# EAGLE design Encoder (EAGLE 9.0.0)
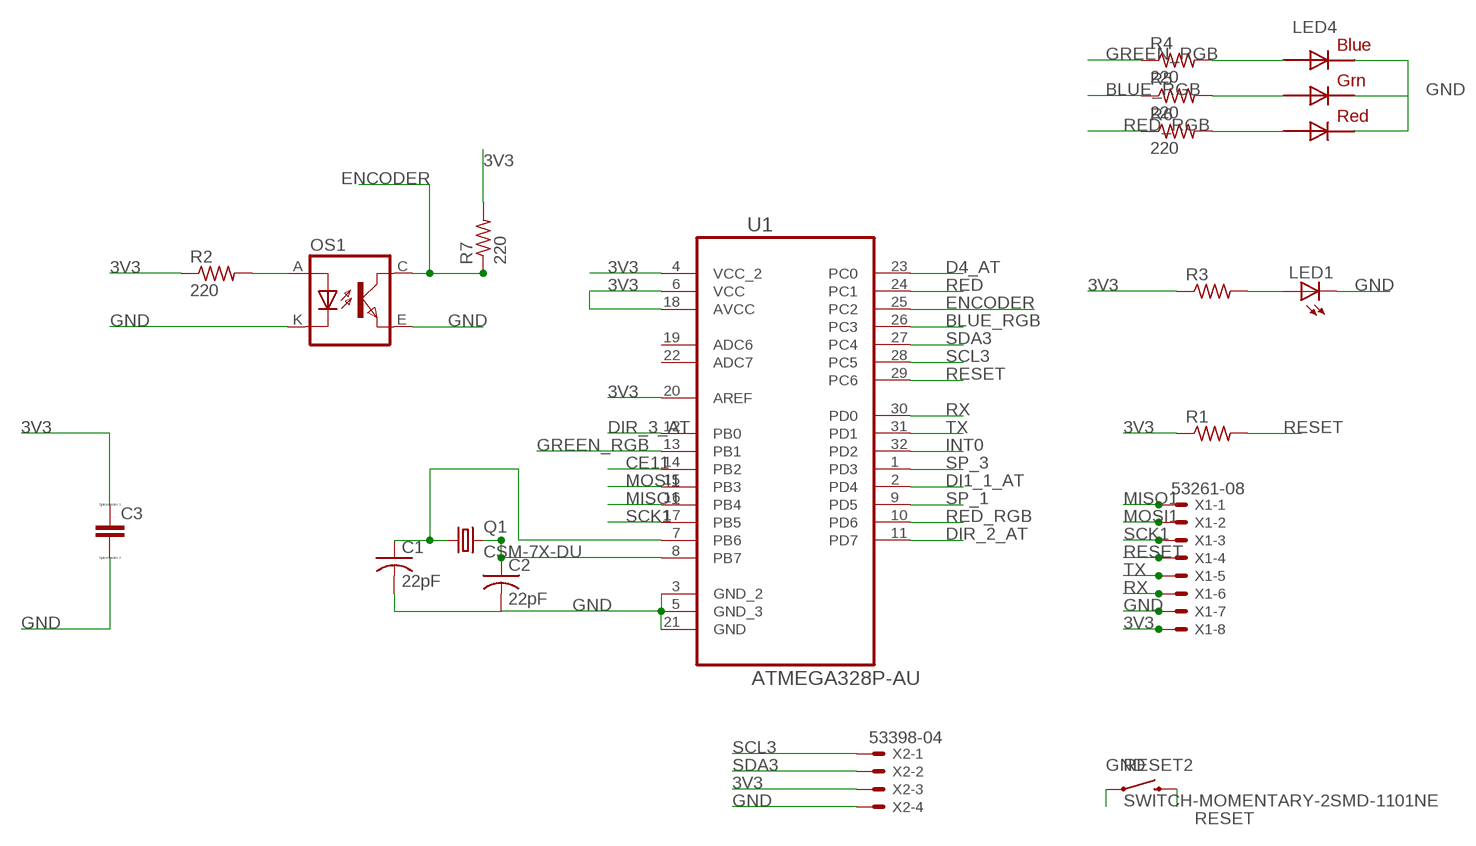
[diagram p0: schematic, sheet 1]

## Parts
C1  22pF  C-USC0603  [C0603]
C2  22pF  C-USC0603  [C0603]
C3  CC1206  [C1206]
LED1  LEDCHIPLED_1206  [CHIPLED_1206]
LED4  RGBLED5050  [RGBLED5050]
OS1  TCRT5000  [TCRT5000]
Q1  CSM-7X-DU  [CSM-7X-DU]
R1  R-US_M1206  [M1206]
R2  220  R-US_R0603  [R0603]
R3  R-US_M1206  [M1206]
R4  220  R-US_R0603  [R0603]
R5  220  R-US_R0603  [R0603]
R6  220  R-US_R0603  [R0603]
R7  220  R-US_R0603  [R0603]
RESET2  SWITCH-MOMENTARY-2SMD-1101NE  [TACTILE-SWITCH-1101NE]
U1  ATMEGA328P-AU  [QFP80P900X900X120-32N]
X1  53261-08  [53261-08]
X2  53398-04  [53398-04]

## Nets
3V3: C3.1 R1.1 R2.1 R3.1 R7.2 U1.4(VCC_2) U1.6(VCC) U1.18(AVCC) U1.20(AREF) X1.8 X2.3
BLUE_RGB: R5.1 U1.26(PC3)
CE11: U1.14(PB2)
D4_AT: U1.23(PC0)
DI1_1_AT: U1.2(PD4)
DIR_2_AT: U1.11(PD7)
DIR_3_AT: U1.12(PB0)
ENCODER: OS1.C(COLLECTOR) R7.1 U1.25(PC2)
GND: C1.2 C2.2 C3.2 LED1.C LED4.4(BLUE_C) LED4.5(RED_C) LED4.6(GREEN_C) OS1.E(EMITTER) OS1.K(CATHODE) RESET2.1 U1.3(GND_2) U1.5(GND_3) U1.21(GND) X1.7 X2.4
GREEN_RGB: R4.1 U1.13(PB1)
INT0: U1.32(PD2)
MISO1: U1.16(PB4) X1.1
MOSI1: U1.15(PB3) X1.2
N$1: C2.1 Q1.2 U1.8(PB7)
N$2: C1.1 Q1.1 U1.7(PB6)
N$3: LED4.3(BLUE_A) R4.2
N$4: LED4.1(GREEN_A) R5.2
N$5: OS1.A(ANODE) R2.2
N$6: LED1.A R3.2
N$8: LED4.2(RED_A) R6.2
RED: U1.24(PC1)
RED_RGB: R6.1 U1.10(PD6)
RESET: R1.2 RESET2.2 U1.29(PC6) X1.4
RX: U1.30(PD0) X1.6
SCK1: U1.17(PB5) X1.3
SCL3: U1.28(PC5) X2.1
SDA3: U1.27(PC4) X2.2
SP_1: U1.9(PD5)
SP_3: U1.1(PD3)
TX: U1.31(PD1) X1.5
Unconnected: U1.19(ADC6) U1.22(ADC7)

## Library data of the parts
C1 C2 = rcl:C-US: CAPACITOR, American symbol
C3 = eagle-ltspice:C: CAPACITOR, European symbol; SPICEMODEL: NONE; SPICEPREFIX: C
LED1 = led:LED: LED OSRAM: - CHIPLED LG R971, LG N971, LY N971, LG Q971, LY Q971, LO R971, LY R971 LH N974, LH R974 LS Q976, LO Q976, LY Q976 LO Q996 - Hyper CHIPLED LW Q18S LB Q993, LB Q99A, LB R99A - SideLED LS A670, LO A670, LY A670, LG A670, LP A670 LB A673, LV A673, LT A673, LW A673 LH A674 LY A675 LS A676, LA A676, LO A676, LY A676, LW A676 LS A679, LY A679, LG A679 - Hyper Micro SIDELED® LS Y876, LA Y876, LO Y876, LY Y876 LT Y87S - SmartLED LW L88C, LW L88S LB L89C, LB L89S, LG L890 LS L89K, LO L89K, LY L89K LS L896, LA L896, LO L896, LY L896 - TOPLED LS T670, LO T670, LY T670, LG T670, LP T670 LSG T670, LSP T670, LSY T670, LOP T670, LYG T670 LG T671, LOG T671, LSG T671 LB T673, LV T673, LT T673, LW T673 LH T674 LS T676, LA T676, LO T676, LY T676, LB T676, LH T676, LSB T676, LW T676 LB T67C, LV T67C, LT T67C, LS T67K, LO T67K, LY T67K, LW E67C LS E67B, LA E67B, LO E67B, LY E67B, LB E67C, LV E67C, LT E67C LW T67C LS T679, LY T679, LG T679 LS T770, LO T770, LY T770, LG T770, LP T770 LB T773, LV T773, LT T773, LW T773 LH T774 LS E675, LA E675, LY E675, LS T675 LS T776, LA T776, LO T776, LY T776, LB T776 LHGB T686 LT T68C, LB T68C - Hyper Mini TOPLED® LB M676 - Mini TOPLED Santana® LG M470 LS M47K, LO M47K, LY M47K Source: http://www.osram.convergy.de LUXEON: - LUMILED® LXK2-PW12-R00, LXK2-PW12-S00, LXK2-PW14-U00, LXK2-PW14-V00 LXK2-PM12-R00, LXK2-PM12-S00, LXK2-PM14-U00 LXK2-PE12-Q00, LXK2-PE12-R00, LXK2-PE12-S00, LXK2-PE14-T00, LXK2-PE14-U00 LXK2-PB12-K00, LXK2-PB12-L00, LXK2-PB12-M00, LXK2-PB14-N00, LXK2-PB14-P00, LXK2-PB14-Q00 LXK2-PR12-L00, LXK2-PR12-M00, LXK2-PR14-Q00, LXK2-PR14-R00 LXK2-PD12-Q00, LXK2-PD12-R00, LXK2-PD12-S00 LXK2-PH12-R00, LXK2-PH12-S00 LXK2-PL12-P00, LXK2-PL12-Q00, LXK2-PL12-R00 Source: www.luxeon.com KINGBRIGHT: KA-3528ASYC Source: www.kingbright.com
LED4 = adafruit:RGBLED: For 5050 RGB LEDs, the order of the LEDs may vary from one manufacturer to another!
OS1 = tcrt5000:TCRT5000
Q1 = crystal:CSM-7X-DU: SMD CRYSTAL Source: www.ecsxtal.com .. Crystal 3.6864MHz CSM_7X_DU.PDF; OC_FARNELL: unknown; OC_NEWARK: unknown
R1-R7 = adafruit:R-US_: RESISTOR, American symbol
RESET2 = SparkFun-Electromechanical:SWITCH-MOMENTARY-2: Various NO switches- pushbuttons, reed, etc; PROD_ID: SWCH-00815
U1 = Atmel_By_element14_Batch_1-00:ATMEGA328P-AU: 8-bit Microcontroller with In-System Programmable Flash; MPN: ATMEGA328P-AU; OC_FARNELL: 1715486; OC_NEWARK: 14R4631; PACKAGE: TQFP-32; SUPPLIER: Atmel
X1 = con-molex:53?-08: CONNECTOR wire to board 1.25 mm (.049 inch) pitch header; MF: MOLEX; OC_FARNELL: 1125376; OC_NEWARK: unknown
X2 = con-molex:53?-04: CONNECTOR wire to board 1.25 mm (.049 inch) pitch header; MF: MOLEX; OC_FARNELL: 1125367; OC_NEWARK: unknown

## Board
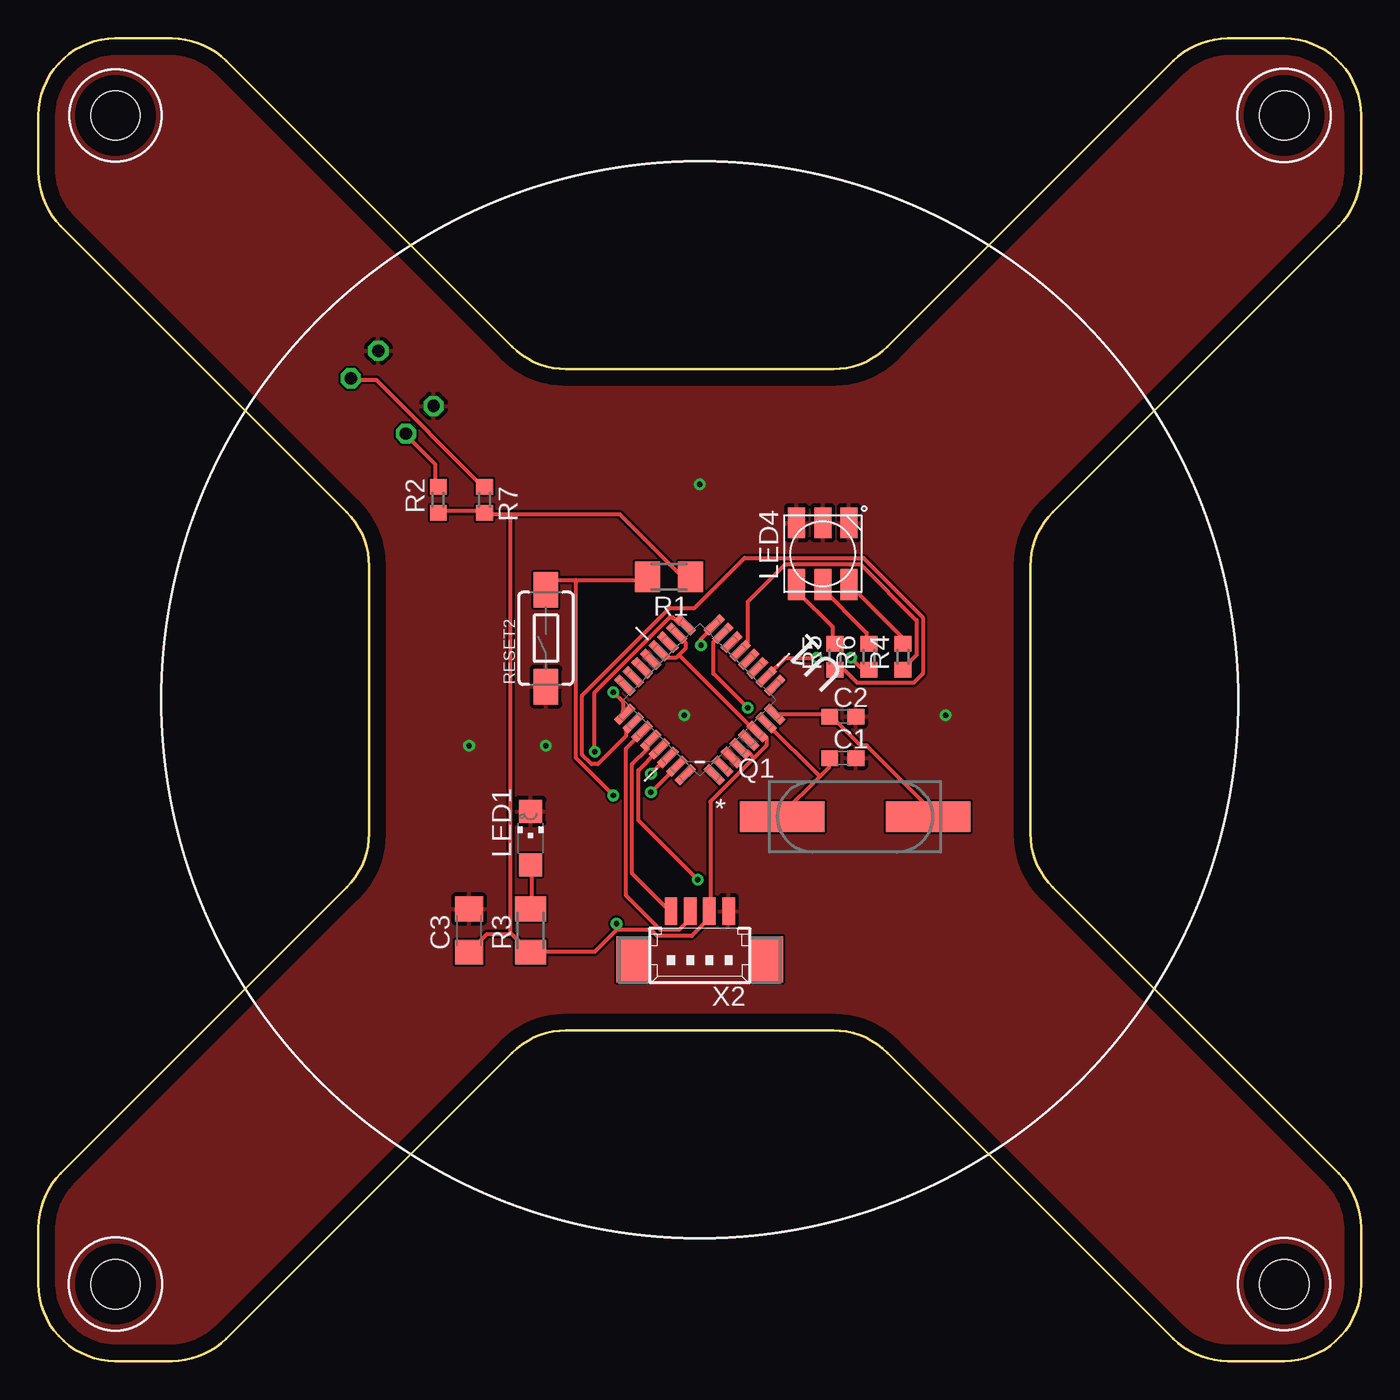
[diagram p1: board, top side]
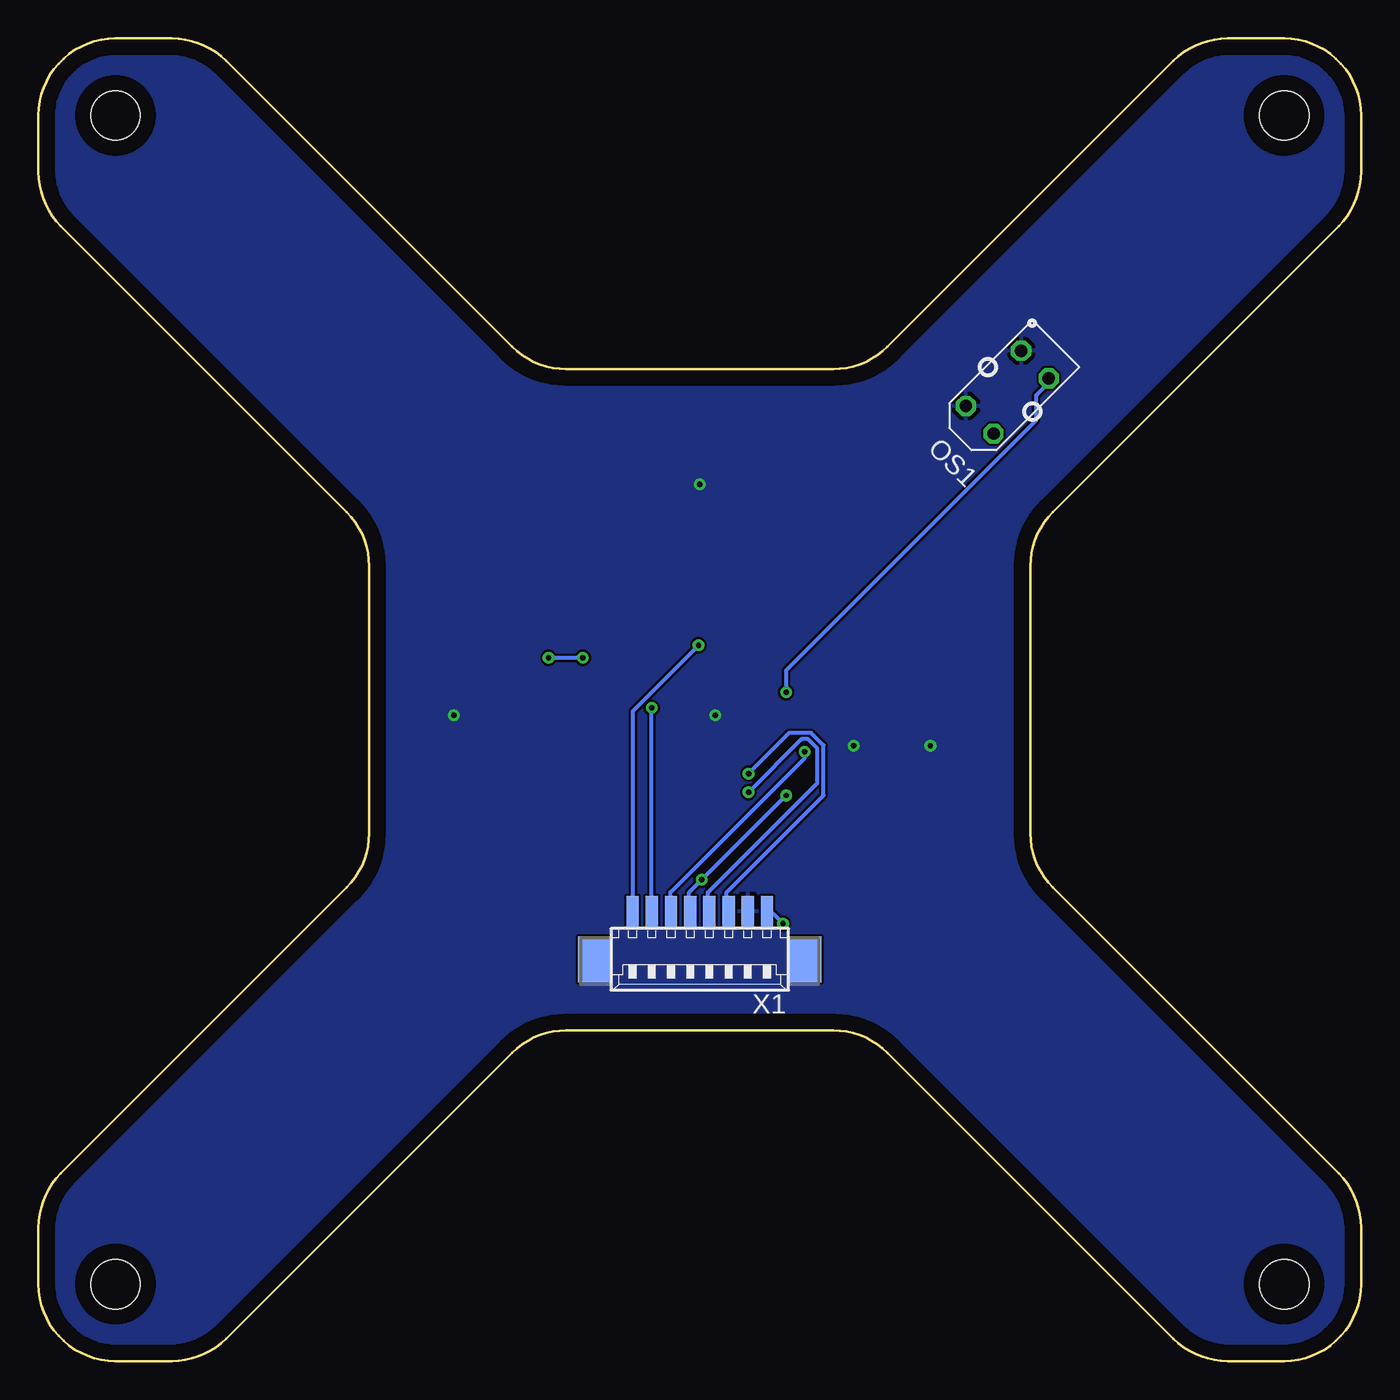
[diagram p2: board, bottom side, seen from below]

Size 86 x 86 mm. Coordinates in mm from the lower left corner, seen from the top.
Outline: 0,81 0,77.32 arc45 1.46,73.79 20.04,55.21 arc-45 21.5,51.68 21.5,34.32 arc-45 20.04,30.79 1.46,12.21 arc45 0,8.68 0,5 arc90 5,0 8.68,0 arc45 12.21,1.46 30.79,20.04 arc-45 34.32,21.5 51.68,21.5 arc-45 55.21,20.04 73.79,1.46 arc45 77.32,0 81,0 arc90 86,5 86,8.68 arc45 84.54,12.21 65.96,30.79 arc-45 64.5,34.32 64.5,51.68 arc-45 65.96,55.21 84.54,73.79 arc45 86,77.32 86,81 arc90 81,86 77.32,86 arc45 73.79,84.54 55.21,65.96 arc-45 51.68,64.5 34.32,64.5 arc-45 30.79,65.96 12.21,84.54 arc45 8.68,86 5,86 arc90 0,81
Copper layers (1*16): Top 0.035mm / dielectric 1.5mm / Bottom 0.035mm
Design rules "default *": minimum track width 10mil, minimum drill 0.35mm, track to track 6mil, track to pad 6mil, pad to pad 6mil, via to via 6mil, smd to smd 6mil, copper to edge 40mil, drill to drill 6mil, minimum pad ring 10mil, minimum via ring 8mil, stop-mask expansion 4mil, vias tented up to drill 30mil, thermal gap 10mil
Holes 3.2 mm at 5,5 81,5 81,81 5,81

### Footprints (pad centres in the part's own frame; a part is rotated, then mirrored left to right if it is on the bottom)
C0603 = smd 1.1 x 1: 1 -0.85,0; 2 0.85,0
C1206 = smd 1.6 x 1.8: 1 -1.4,0; 2 1.4,0
CHIPLED_1206 = smd 1.5 x 1.5: A 0,-1.75; C 0,1.75
RGBLED5050 = smd 2 x 1.1: 1 -2,1.7; 2 -2,0; 3 -2,-1.7; 4 2,-1.7; 5 2,0; 6 2,1.7
TCRT5000 = drill 0.8 octagon: A -2.54,-1.27; C 2.54,-1.27; E 2.54,1.27; K -2.54,1.27
CSM-7X-DU = smd 5.5 x 2: 1 -4.75,0; 2 4.75,0
M1206 = smd 1.6 x 2: 1 -1.4,0; 2 1.4,0
R0603 = smd 1 x 1.1: 1 -0.85,0; 2 0.85,0
TACTILE-SWITCH-1101NE = smd 2.3 x 1.6: 1 -3.15,0; 2 3.15,0
QFP80P900X900X120-32N = smd 1.473 x 0.508: 1 -4.115,2.794; 2 -4.115,2.007; 3 -4.115,1.194; 4 -4.115,0.406; 5 -4.115,-0.406; 6 -4.115,-1.194; 7 -4.115,-2.007; 8 -4.115,-2.794; 17 4.115,-2.794; 18 4.115,-2.007; 19 4.115,-1.194; 20 4.115,-0.406; 21 4.115,0.406; 22 4.115,1.194; 23 4.115,2.007; 24 4.115,2.794 | smd 0.508 x 1.473: 9 -2.794,-4.115; 10 -2.007,-4.115; 11 -1.194,-4.115; 12 -0.406,-4.115; 13 0.406,-4.115; 14 1.194,-4.115; 15 2.007,-4.115; 16 2.794,-4.115; 25 2.794,4.115; 26 2.007,4.115; 27 1.194,4.115; 28 0.406,4.115; 29 -0.406,4.115; 30 -1.194,4.115; 31 -2.007,4.115; 32 -2.794,4.115
53261-08 = smd 0.8 x 2: 1 4.375,-2.5; 2 3.125,-2.5; 3 1.875,-2.5; 4 0.625,-2.5; 5 -0.625,-2.5; 6 -1.875,-2.5; 7 -3.125,-2.5; 8 -4.375,-2.5 | smd 2.1 x 3: S1 6.875,0.625; S2 -6.875,0.625
53398-04 = smd 0.8 x 1.8: 1 1.875,-2.5; 2 0.625,-2.5; 3 -0.625,-2.5; 4 -1.875,-2.5 | smd 2.1 x 3: S1 4.375,0.625; S2 -4.375,0.625

### Placement (x,y rotation side)
C1  52.3,39.2 0 top
C2  52.3,41.9 0 top
C3  28,28 90 top
LED1  32,34 0 top
LED4  51,52.5 90 top
OS1  23,63 45 bottom
Q1  53.1,35.4 0 top
R1  41,51 180 top
R2  26,56 90 top
R3  32,28 90 top
R4  56.2,45.8 90 top
R5  51.8,45.8 90 top
R6  54,45.8 90 top
R7  29,56 270 top
RESET2  33,47 90 top
U1  43,43 135 top
X1  43,26.75 180 bottom
X2  43,26.75 180 top

### Tracks (layer width: path | path; a pad name or v marks a point on that pad's centre or on a via)
3V3  (via drill 0.35)
  Top 0.254: R2.1 26.01,55.27 28.85,55.27 R7.2 29.06,55.07 30.68,55.07 | 30.68,55.07 37.8,55.07 41.86,51 42.27,51 R1.1 | 41.66,45.92 42.06,46.33 42.06,46.74 41.66,47.14 U1.18 | 41.66,45.92 41.45,45.72 40.84,45.72 40.44,46.13 U1.20 | 46.53,39.22 46.13,39.62 45.72,39.62 U1.4 | 46.53,39.22 47.35,40.03 47.35,40.44 46.94,40.84 U1.6 46.74,40.84 41.66,45.92 | 46.53,39.22 43.69,36.37 43.69,29.26 X2.3 43.48,29.06 43.48,28.65 42.47,27.64 40.23,27.64 39.83,28.04 37.59,28.04 | 37.59,28.04 36.17,26.62 32.11,26.62 R3.1 31.9,26.62 30.76,27.76 | 37.59,28.04 v37.59,28.45 | 30.68,55.07 30.68,27.84 30.76,27.76 | C3.1 29.16,27.76 30.76,27.76
  Bottom 0.254: v37.59,28.45 38.2,29.06 38.61,29.06 X1.8
BLUE_RGB
  Top 0.254: R5.1 51.82,44.91 52.43,44.91 53.24,44.09 56.9,44.09 57.51,44.7 57.51,48.36 53.65,52.22 45.92,52.22 42.67,48.97 41.05,48.97 35.36,43.28 35.36,39.42 35.97,38.81 36.37,38.81 38.2,40.64 38.2,41.05 38.61,41.45 U1.26
ENCODER  (via drill 0.35)
  Top 0.254: R7.1 28.85,56.9 21.95,63.8 20.32,63.8 OS1.C | v37.39,43.48 38,42.88 38,42.27 U1.25
  Bottom 0.254: v37.39,43.48 37.39,44.91 21.13,61.16 21.13,62.79 20.12,63.8 OS1.C
GND  (via drill 0.35)
  other vias: 42,42 33,40 28,40 43,57 59,42
  pour Top: 8.68,0 5,0 arc-90 0,5 0,8.68 arc-45 1.46,12.21 20.04,30.79 arc45 21.5,34.32 21.5,51.68 arc45 20.04,55.21 1.46,73.79 arc-45 0,77.32 0,81 arc-90 5,86 8.68,86 arc-45 12.21,84.54 30.79,65.96 arc45 34.32,64.5 51.68,64.5 arc45 55.21,65.96 73.79,84.54 arc-45 77.32,86 81,86 arc-90 86,81 86,77.32 arc-45 84.54,73.79 65.96,55.21 arc45 64.5,51.68 64.5,34.32 arc45 65.96,30.79 84.54,12.21 arc-45 86,8.68 86,5 arc-90 81,0 77.32,0 arc-45 73.79,1.46 55.21,20.04 arc45 51.68,21.5 34.32,21.5 arc45 30.79,20.04 12.21,1.46 arc-45
  pour Bottom: 8.68,0 5,0 arc-90 0,5 0,8.68 arc-45 1.46,12.21 20.04,30.79 arc45 21.5,34.32 21.5,51.68 arc45 20.04,55.21 1.46,73.79 arc-45 0,77.32 0,81 arc-90 5,86 8.68,86 arc-45 12.21,84.54 30.79,65.96 arc45 34.32,64.5 51.68,64.5 arc45 55.21,65.96 73.79,84.54 arc-45 77.32,86 81,86 arc-90 86,81 86,77.32 arc-45 84.54,73.79 65.96,55.21 arc45 64.5,51.68 64.5,34.32 arc45 65.96,30.79 84.54,12.21 arc-45 86,8.68 86,5 arc-90 81,0 77.32,0 arc-45 73.79,1.46 55.21,20.04 arc45 51.68,21.5 34.32,21.5 arc45 30.79,20.04 12.21,1.46 arc-45
GREEN_RGB
  Top 0.254: R4.1 56.29,45.11 57.1,45.92 57.1,48.16 53.44,51.82 48.56,51.82 46.13,49.38 46.13,46.74 45.72,46.33 U1.13
MISO1  (via drill 0.35)
  Top 0.254: v43.08,46.53 43.08,46.94 43.89,47.75 U1.16
  Bottom 0.254: v43.08,46.53 47.35,42.27 47.35,29.26 X1.1
MOSI1  (via drill 0.35)
  Top 0.254: v46.13,42.47 43.89,44.7 43.89,46.74 44.3,47.14 U1.15
  Bottom 0.254: v46.13,42.47 X1.2
N$1
  Top 0.254: U1.8 47.95,42.06 51.41,42.06 C2.1 51.61,41.86 53.44,40.03 53.85,40.03 57.71,36.17 57.71,35.56 Q1.2
N$2
  Top 0.254: 50.8,38 48.36,35.56 Q1.1 | 50.8,38 51.41,38.61 51.41,39.01 C1.1 | 50.8,38 47.35,41.45 U1.7
N$3
  Top 0.254: R4.2 56.08,46.74 56.08,47.14 52.83,50.39 LED4.3
N$4
  Top 0.254: R5.2 51.61,46.74 51.61,47.75 49.38,49.99 49.38,50.39 LED4.1
N$5
  Top 0.254: R2.2 25.81,56.9 25.81,58.32 23.98,60.15 OS1.A
N$6
  Top 0.254: LED1.A 32.11,32.11 32.11,29.46 R3.2
N$8
  Top 0.254: R6.2 53.85,46.74 53.85,47.35 50.8,50.39 LED4.2
RED_RGB  (via drill 0.35)
  Top 0.254: v52.83,45.72 53.44,45.11 53.85,45.11 R6.1 | v50.6,45.72 48.56,45.72 47.35,44.5 U1.10
  Bottom 0.254: v50.6,45.72 v52.83,45.72
RESET  (via drill 0.35)
  Top 0.254: 34.95,50.8 33.73,50.8 33.12,50.19 RESET2.2 | 34.95,50.8 39.42,50.8 R1.2 | v42.88,31.29 39.01,35.15 39.01,38.41 40.23,39.62 U1.29 | 34.95,50.8 34.95,39.22 v37.39,36.78
  Bottom 0.254: X1.4 43.69,29.26 43.69,30.48 v42.88,31.29 v37.39,36.78
RX  (via drill 0.35)
  Top 0.254: v39.83,38.2 40.84,39.22 U1.30
  Bottom 0.254: v39.83,38.2 37.19,40.84 35.76,40.84 34.95,40.03 34.95,36.78 41.25,30.48 41.25,29.26 X1.6
SCK1  (via drill 0.35)
  Top 0.254: v36.17,39.62 36.17,43.48 41.05,48.36 41.25,48.36 41.66,47.95 42.06,47.95 U1.17
  Bottom 0.254: v36.17,39.62 36.17,39.22 44.91,30.48 44.91,29.26 X1.3
SCL3
  Top 0.254: U1.28 39.62,40.23 39.62,39.83 38.61,38.81 38.61,31.7 41.05,29.26 X2.1
SDA3
  Top 0.254: U1.27 39.22,40.84 38.2,39.83 38.2,30.28 40.44,28.04 41.66,28.04 42.27,28.65 42.27,29.06 X2.2
TX  (via drill 0.35)
  Top 0.254: v39.83,36.98 41.45,38.61 U1.31
  Bottom 0.254: v39.83,36.98 36.37,40.44 35.97,40.44 35.36,39.83 35.36,37.59 42.47,30.48 42.47,29.26 X1.5